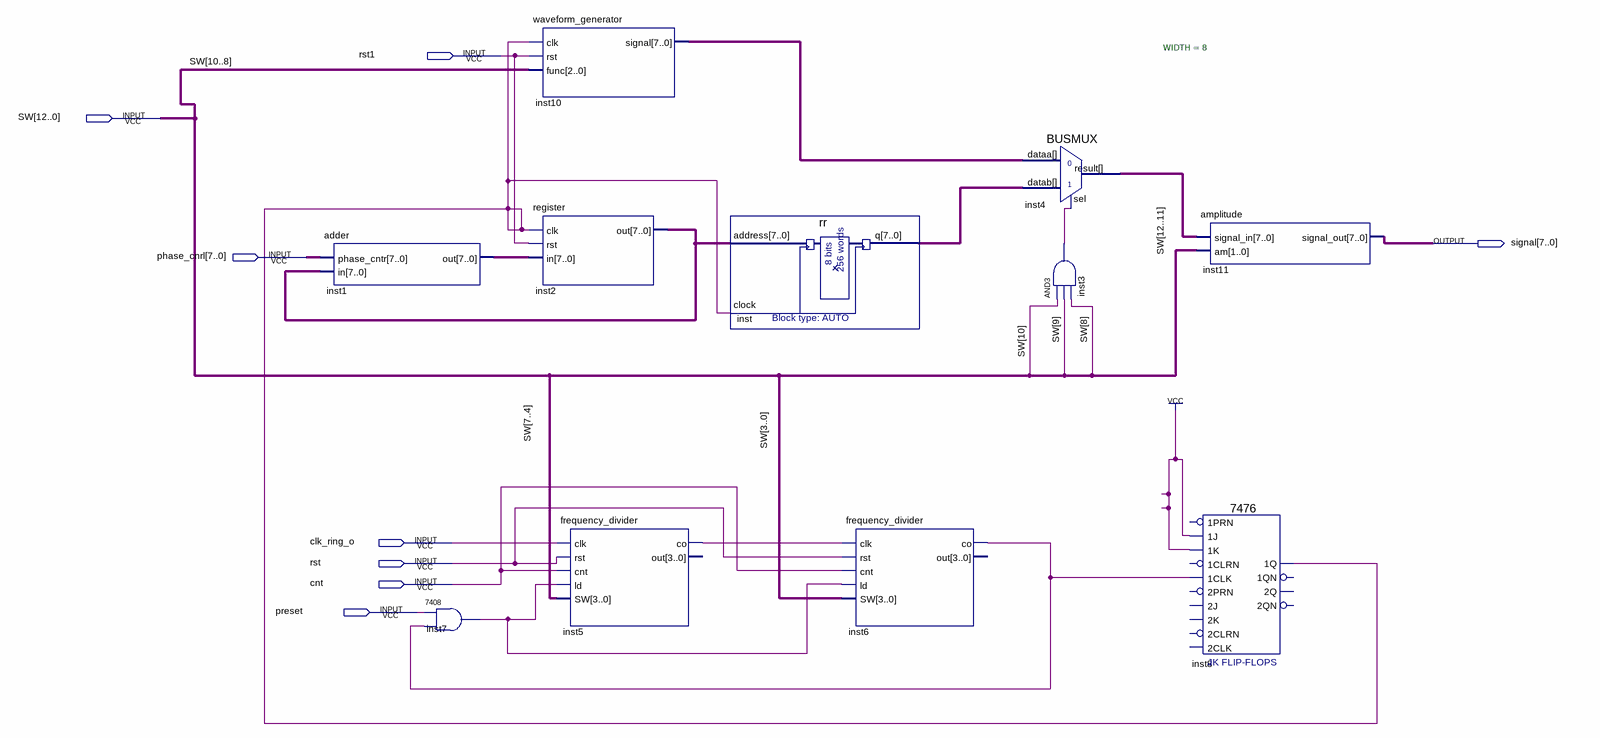
[diagram p0: schematic sheet]
// Quartus schematic total_design.bdf as structural Verilog: 11 symbols, 8 pins
module total_design (
  input  rst1,
  input  [12:0] SW,
  input  [7:0] phase_cnrl,
  input  clk_ring_o,
  input  rst,
  input  cnt,
  input  preset,
  output [7:0] signal
);

  wire inst3_out, inst5_co, inst6_co, inst7_1, inst8_1q;
  wire [7:0] inst1_out, inst2_out, inst4_result, inst10_signal, inst_q;

  adder inst1 (.phase_cntr(phase_cnrl), .in(inst2_out), .out(inst1_out));
  \7408  inst7 (.\3 (inst6_co), .\2 (preset), .\1 (inst7_1));
  waveform_generator inst10 (.clk(inst8_1q), .rst(rst1), .func(SW[10:8]), .signal(inst10_signal));
  register inst2 (.clk(inst8_1q), .rst(rst1), .in(inst1_out), .out(inst2_out));
  frequency_divider inst5 (
    .clk(clk_ring_o), .rst(rst), .cnt(cnt), .ld(inst7_1), .SW(SW[7:4]), .co(inst5_co));  // open: out
  rr inst (.address(inst2_out), .clock(inst8_1q), .q(inst_q));
  frequency_divider inst6 (
    .clk(inst5_co), .rst(rst), .cnt(cnt), .ld(inst7_1), .SW(SW[3:0]), .co(inst6_co));  // open: out
  BUSMUX #(.WIDTH(8)) inst4 (.datab(inst_q), .sel(inst3_out), .dataa(inst10_signal), .result(inst4_result));
  and inst3 (inst3_out, SW[10], SW[9], SW[8]);
  amplitude inst11 (.signal_in(inst4_result), .am(SW[12:11]), .signal_out(signal));
  \7476  inst8 (
    .\1J (1'b1), .\1K (1'b1), .\1CLK (inst6_co), .\1Q (inst8_1q));  // open: 1PRN, 2PRN, 2J, 1CLRN, 2K, 2CLRN, 2CLK, 2QN, 2Q, 1QN
endmodule
